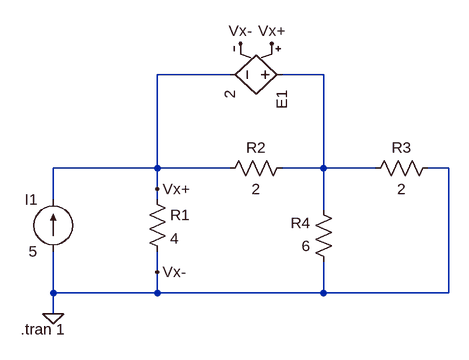
[diagram p0: schematic jalase-1.asc]
jalase-1.asc, the LTspice schematic file:
Version 4
SHEET 1 880 680
WIRE 320 -48 208 -48
WIRE 464 -48 400 -48
WIRE 208 96 208 -48
WIRE 208 96 48 96
WIRE 320 96 208 96
WIRE 464 96 464 -48
WIRE 464 96 400 96
WIRE 544 96 464 96
WIRE 656 96 624 96
WIRE 208 128 208 96
WIRE 48 144 48 96
WIRE 208 144 208 128
WIRE 464 160 464 96
WIRE 208 256 208 224
WIRE 48 288 48 224
WIRE 208 288 208 256
WIRE 208 288 48 288
WIRE 464 288 464 240
WIRE 464 288 208 288
WIRE 656 288 656 96
WIRE 656 288 464 288
WIRE 48 320 48 288
FLAG 208 128 Vx+
FLAG 384 -96 Vx+
FLAG 336 -96 Vx-
FLAG 208 256 Vx-
FLAG 48 320 0
SYMBOL current 48 224 R180
WINDOW 0 24 80 Left 2
WINDOW 3 24 0 Left 2
WINDOW 123 0 0 Left 0
WINDOW 39 0 0 Left 0
SYMATTR InstName I1
SYMATTR Value 5
SYMBOL res 192 128 R0
SYMATTR InstName R1
SYMATTR Value 4
SYMBOL res 416 80 R90
WINDOW 0 0 56 VBottom 2
WINDOW 3 32 56 VTop 2
SYMATTR InstName R2
SYMATTR Value 2
SYMBOL res 640 80 R90
WINDOW 0 0 56 VBottom 2
WINDOW 3 32 56 VTop 2
SYMATTR InstName R3
SYMATTR Value 2
SYMBOL res 480 256 R180
WINDOW 0 36 76 Left 2
WINDOW 3 36 40 Left 2
SYMATTR InstName R4
SYMATTR Value 6
SYMBOL e 416 -48 R90
SYMATTR InstName E1
SYMATTR Value 2
TEXT -2 344 Left 2 !.tran 1

The netlist it stands for:
* jalase-1.asc
I1 0 Vx+ 5
R1 Vx+ 0 4
R2 N001 Vx+ 2
R3 0 N001 2
R4 0 N001 6
E1 N001 Vx+ Vx+ 0 2
.tran 1
.backanno
.end